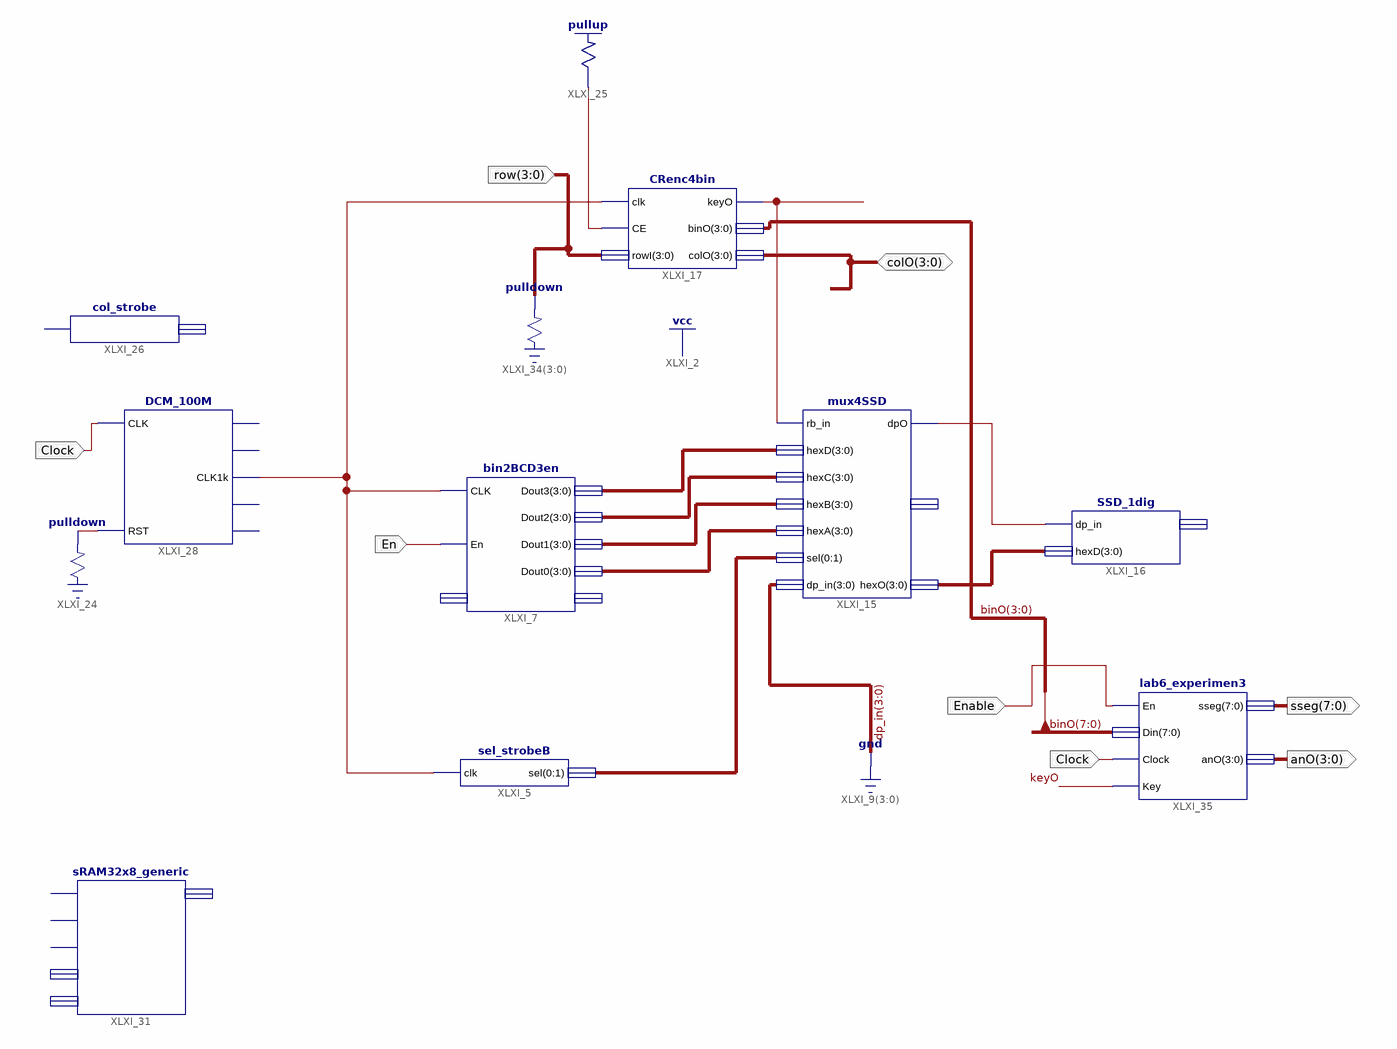
[diagram p0: schematic sheet 1]
// Xilinx ISE schematic lab_final_keypad.sch (spartan3e) as structural Verilog: 12 symbols, 7 ports
module lab_final_keypad (
  input  En,
  input  [3:0] row,
  input  Clock,
  input  Enable,
  inout  [3:0] colO,
  output [7:0] sseg,
  output [3:0] anO
);

  wire keyO, XLXN_43, XLXN_44, XLXN_47, XLXN_57;
  wire [1:0] XLXN_15;
  wire [3:0] XLXN_2, XLXN_3, XLXN_4, XLXN_6, XLXN_7;
  wire [7:0] binO;

  mux4SSD XLXI_15 (
    .rb_in(keyO), .hexD(XLXN_6), .hexC(XLXN_4), .hexB(XLXN_3), .hexA(XLXN_2), .sel({XLXN_15[0], XLXN_15[1]}),
    .dp_in(4'b0000), .dpO(XLXN_47), .hexO(XLXN_7));  // open: anO
  SSD_1dig XLXI_16 (.dp_in(XLXN_47), .hexD(XLXN_7));  // open: sseg
  CRenc4bin XLXI_17 (.clk(XLXN_57), .CE(XLXN_44), .rowI(row), .keyO(keyO), .binO(binO[3:0]), .colO(colO));
  sel_strobeB XLXI_5 (.clk(XLXN_57), .sel({XLXN_15[0], XLXN_15[1]}));
  bin2BCD3en XLXI_7 (
    .CLK(XLXN_57), .En(En), .Dout3(XLXN_6), .Dout2(XLXN_4), .Dout1(XLXN_3), .Dout0(XLXN_2));  // open: Din, RBout
  \pulldown  XLXI_24 (.O(XLXN_43));
  \pullup  XLXI_25 (.O(XLXN_44));
  col_strobe XLXI_26 ();  // open: clk, col
  DCM_100M XLXI_28 (.CLK(Clock), .RST(XLXN_43), .CLK1k(XLXN_57));  // open: CLK1M, CLK10k, CLK100, CLK1
  sRAM32x8_generic XLXI_31 ();  // open: nCS, nWE, WCLK, A, D, Q
  \pulldown  XLXI_34[3:0] (.O(row));
  lab6_experimen3 XLXI_35 (.En(Enable), .Din(binO), .Clock(Clock), .sseg(sseg), .anO(anO), .Key(keyO));
endmodule
